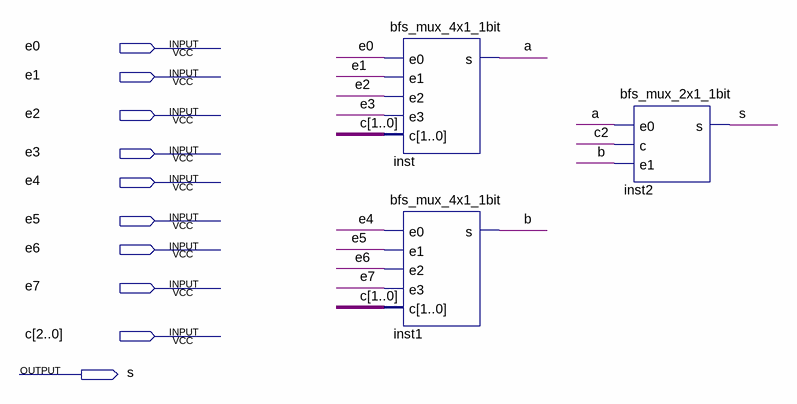
[diagram p0: schematic sheet]
// Quartus schematic bfs_mux_8x1.bdf as structural Verilog: 3 symbols, 10 pins
module bfs_mux_8x1 (
  input  e0,
  input  e1,
  input  e2,
  input  e3,
  input  e4,
  input  e5,
  input  e6,
  input  e7,
  input  [2:0] c,
  output s
);

  wire a, b;

  bfs_mux_4x1_1bit inst (.e0(e0), .e1(e1), .e2(e2), .e3(e3), .c(c[1:0]), .s(a));
  bfs_mux_4x1_1bit inst1 (.e0(e4), .e1(e5), .e2(e6), .e3(e7), .c(c[1:0]), .s(b));
  bfs_mux_2x1_1bit inst2 (.e0(a), .c(c[2]), .e1(b), .s(s));
endmodule
